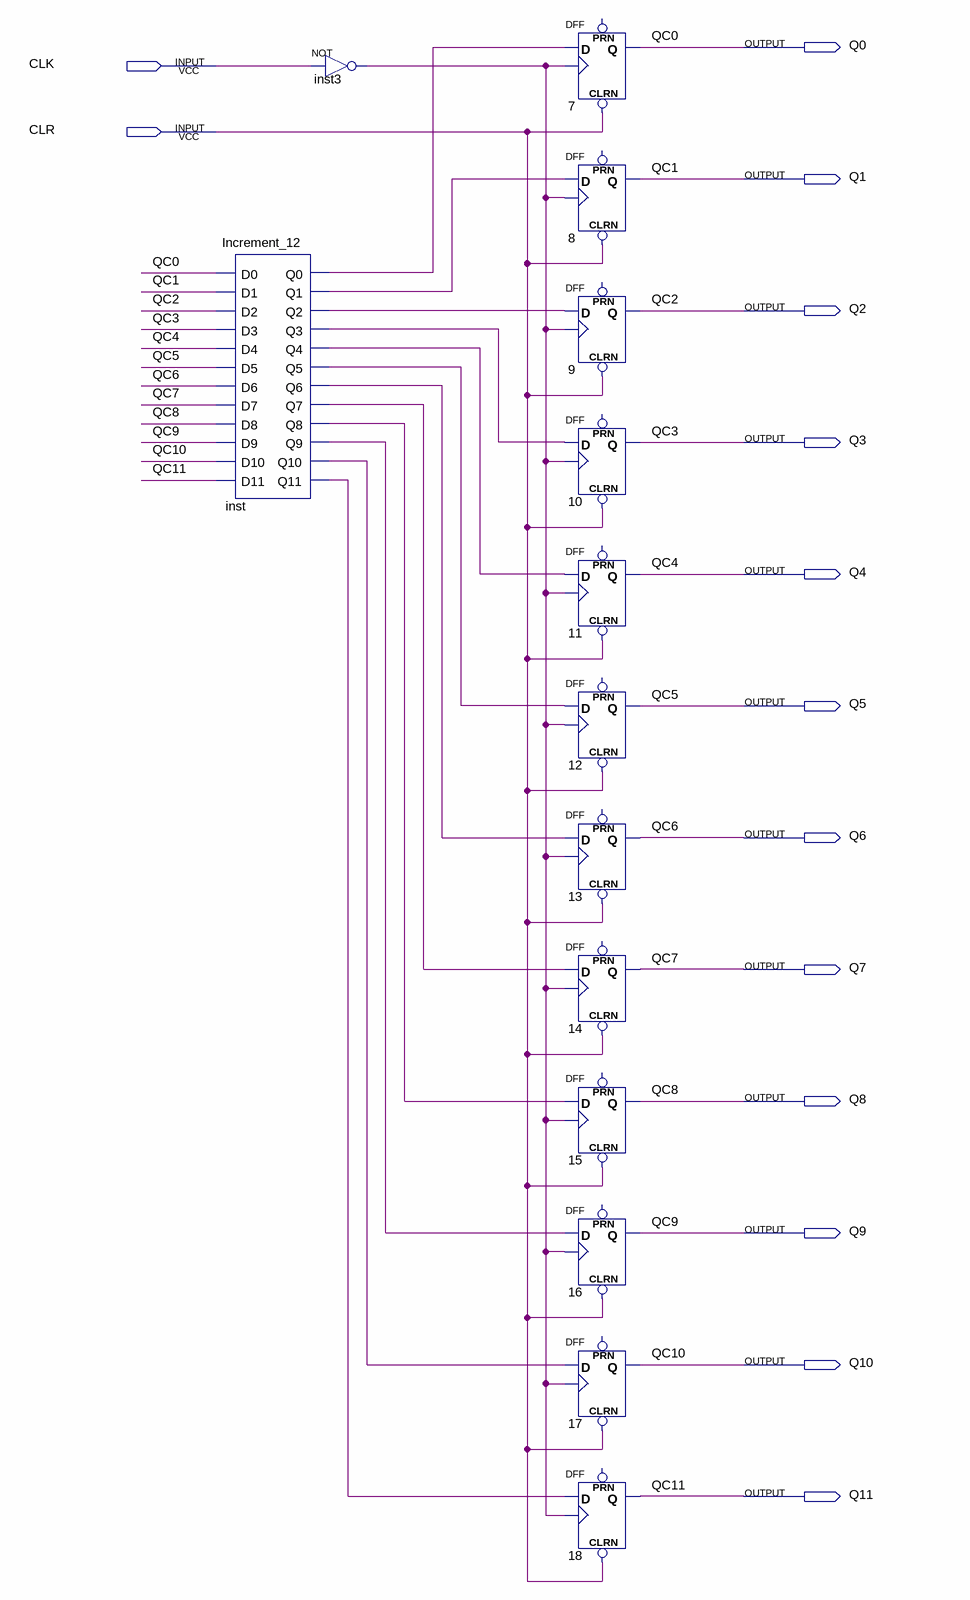
[diagram p0: schematic sheet]
// Quartus schematic Counter_12.bdf as structural Verilog: 14 symbols, 14 pins
module Counter_12 (
  input  CLK,
  input  CLR,
  output Q0,
  output Q1,
  output Q2,
  output Q3,
  output Q4,
  output Q5,
  output Q6,
  output Q7,
  output Q8,
  output Q9,
  output Q10,
  output Q11
);

  wire inst3_out, inst_q0, inst_q1, inst_q2, inst_q3, inst_q4, inst_q5, inst_q6, inst_q7, inst_q8, inst_q9,
       inst_q10, inst_q11;

  Increment_12 inst (
    .D0(Q0), .D1(Q1), .D2(Q2), .D3(Q3), .D4(Q4), .D5(Q5), .D6(Q6), .D7(Q7), .D8(Q8), .D9(Q9), .D10(Q10),
    .D11(Q11), .Q0(inst_q0), .Q1(inst_q1), .Q2(inst_q2), .Q3(inst_q3), .Q4(inst_q4), .Q5(inst_q5),
    .Q6(inst_q6), .Q7(inst_q7), .Q8(inst_q8), .Q9(inst_q9), .Q10(inst_q10), .Q11(inst_q11));
  not inst3 (inst3_out, CLK);
  DFF u_7 (.CLRN(CLR), .CLK(inst3_out), .D(inst_q0), .Q(Q0));  // open: PRN
  DFF u_8 (.CLRN(CLR), .CLK(inst3_out), .D(inst_q1), .Q(Q1));  // open: PRN
  DFF u_9 (.CLRN(CLR), .CLK(inst3_out), .D(inst_q2), .Q(Q2));  // open: PRN
  DFF u_10 (.CLRN(CLR), .CLK(inst3_out), .D(inst_q3), .Q(Q3));  // open: PRN
  DFF u_11 (.CLRN(CLR), .CLK(inst3_out), .D(inst_q4), .Q(Q4));  // open: PRN
  DFF u_12 (.CLRN(CLR), .CLK(inst3_out), .D(inst_q5), .Q(Q5));  // open: PRN
  DFF u_13 (.CLRN(CLR), .CLK(inst3_out), .D(inst_q6), .Q(Q6));  // open: PRN
  DFF u_14 (.CLRN(CLR), .CLK(inst3_out), .D(inst_q7), .Q(Q7));  // open: PRN
  DFF u_15 (.CLRN(CLR), .CLK(inst3_out), .D(inst_q8), .Q(Q8));  // open: PRN
  DFF u_16 (.CLRN(CLR), .CLK(inst3_out), .D(inst_q9), .Q(Q9));  // open: PRN
  DFF u_17 (.CLRN(CLR), .CLK(inst3_out), .D(inst_q10), .Q(Q10));  // open: PRN
  DFF u_18 (.CLRN(CLR), .CLK(inst3_out), .D(inst_q11), .Q(Q11));  // open: PRN

  // Other names for the same wires on the sheet: QC0 = Q0; QC1 = Q1; QC2 = Q2; QC3 = Q3; QC4 = Q4; QC5 = Q5; QC6 = Q6;
  //   QC7 = Q7; QC8 = Q8; QC9 = Q9; QC10 = Q10; QC11 = Q11
endmodule
